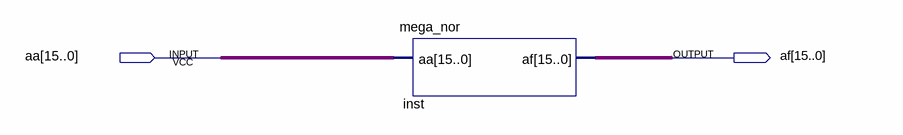
[diagram p0: schematic sheet]
// Quartus schematic Block1.bdf as structural Verilog: 1 symbols, 2 pins
module Block1 (
  input  [15:0] aa,
  output [15:0] af
);

  mega_nor inst (.aa(aa), .af(af));
endmodule
